# EAGLE schematic middleman pcb (EAGLE 9.5.0)
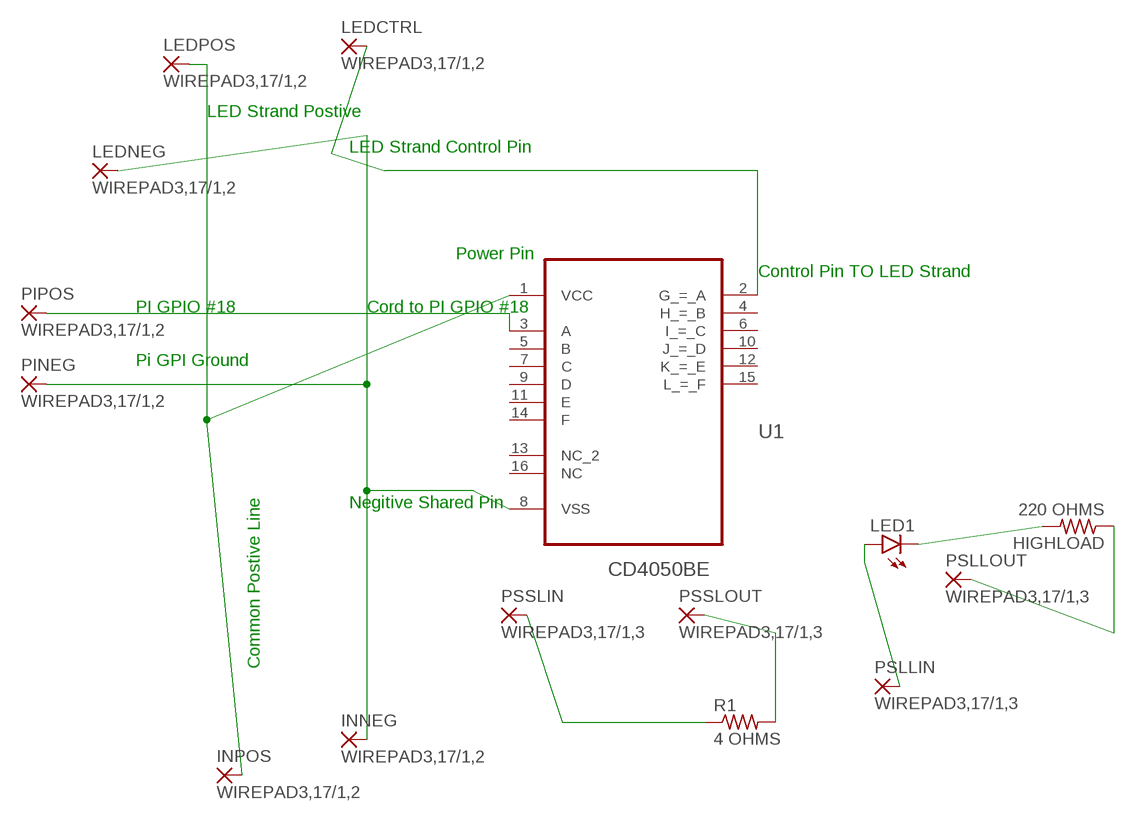
[diagram p0: schematic, sheet 1]

## Parts
HIGHLOAD  220 OHMS  R-US_R0805  [R0805]
INNEG  WIREPAD3,17/1,2  [3,17/1,2]
INPOS  WIREPAD3,17/1,2  [3,17/1,2]
LED1  LED3MM  [LED3MM]
LEDCTRL  WIREPAD3,17/1,2  [3,17/1,2]
LEDNEG  WIREPAD3,17/1,2  [3,17/1,2]
LEDPOS  WIREPAD3,17/1,2  [3,17/1,2]
PINEG  WIREPAD3,17/1,2  [3,17/1,2]
PIPOS  WIREPAD3,17/1,2  [3,17/1,2]
PSLLIN  WIREPAD3,17/1,3  [3,17/1,3]
PSLLOUT  WIREPAD3,17/1,3  [3,17/1,3]
PSSLIN  WIREPAD3,17/1,3  [3,17/1,3]
PSSLOUT  WIREPAD3,17/1,3  [3,17/1,3]
R1  4 OHMS  R-US_R0805  [R0805]
U1  CD4050BE  [DIP254P762X508-16]

## Nets
N$1: INPOS.1(P) LEDPOS.1(P) U1.1(VCC)
N$2: LEDCTRL.1(P) U1.2(G_=_A)
N$3: PIPOS.1(P) U1.3(A)
N$4: LED1.A PSLLIN.1(P)
N$5: INNEG.1(P) LEDNEG.1(P) PINEG.1(P) U1.8(VSS)
N$6: HIGHLOAD.2 LED1.K(C)
N$7: HIGHLOAD.1 PSLLOUT.1(P)
N$8: PSSLIN.1(P) R1.1
N$9: PSSLOUT.1(P) R1.2
Unconnected: U1.4(H_=_B) U1.5(B) U1.6(I_=_C) U1.7(C) U1.9(D) U1.10(J_=_D) U1.11(E) U1.12(K_=_E) U1.13(NC_2) U1.14(F) U1.15(L_=_F) U1.16(NC)

## Notes on the sheet
- LED Strand Postive
- LED Strand Control Pin
- Power Pin
- Control Pin TO LED Strand
- PI GPIO #18 | Cord to PI GPIO #18
- Pi GPI Ground
- Negitive Shared Pin
- Common Postive Line

## Library data of the parts
HIGHLOAD R1 = rcl:R-US_: RESISTOR, American symbol; SPICEPREFIX: R
INNEG INPOS LEDCTRL LEDNEG LEDPOS PINEG PIPOS PSLLIN PSLLOUT PSSLIN PSSLOUT = wirepad:WIREPAD: Wire PAD connect wire on PCB
LED1 = led:LED: LED OSRAM: - CHIPLED LG R971, LG N971, LY N971, LG Q971, LY Q971, LO R971, LY R971 LH N974, LH R974 LS Q976, LO Q976, LY Q976 LO Q996 - Hyper CHIPLED LW Q18S LB Q993, LB Q99A, LB R99A - SideLED LS A670, LO A670, LY A670, LG A670, LP A670 LB A673, LV A673, LT A673, LW A673 LH A674 LY A675 LS A676, LA A676, LO A676, LY A676, LW A676 LS A679, LY A679, LG A679 - Hyper Micro SIDELED® LS Y876, LA Y876, LO Y876, LY Y876 LT Y87S - SmartLED LW L88C, LW L88S LB L89C, LB L89S, LG L890 LS L89K, LO L89K, LY L89K LS L896, LA L896, LO L896, LY L896 - TOPLED LS T670, LO T670, LY T670, LG T670, LP T670 LSG T670, LSP T670, LSY T670, LOP T670, LYG T670 LG T671, LOG T671, LSG T671 LB T673, LV T673, LT T673, LW T673 LH T674 LS T676, LA T676, LO T676, LY T676, LB T676, LH T676, LSB T676, LW T676 LB T67C, LV T67C, LT T67C, LS T67K, LO T67K, LY T67K, LW E67C LS E67B, LA E67B, LO E67B, LY E67B, LB E67C, LV E67C, LT E67C LW T67C LS T679, LY T679, LG T679 LS T770, LO T770, LY T770, LG T770, LP T770 LB T773, LV T773, LT T773, LW T773 LH T774 LS E675, LA E675, LY E675, LS T675 LS T776, LA T776, LO T776, LY T776, LB T776 LHGB T686 LT T68C, LB T68C - Hyper Mini TOPLED® LB M676 - Mini TOPLED Santana® LG M470 LS M47K, LO M47K, LY M47K Source: http://www.osram.convergy.de LUXEON: - LUMILED® LXK2-PW12-R00, LXK2-PW12-S00, LXK2-PW14-U00, LXK2-PW14-V00 LXK2-PM12-R00, LXK2-PM12-S00, LXK2-PM14-U00 LXK2-PE12-Q00, LXK2-PE12-R00, LXK2-PE12-S00, LXK2-PE14-T00, LXK2-PE14-U00 LXK2-PB12-K00, LXK2-PB12-L00, LXK2-PB12-M00, LXK2-PB14-N00, LXK2-PB14-P00, LXK2-PB14-Q00 LXK2-PR12-L00, LXK2-PR12-M00, LXK2-PR14-Q00, LXK2-PR14-R00 LXK2-PD12-Q00, LXK2-PD12-R00, LXK2-PD12-S00 LXK2-PH12-R00, LXK2-PH12-S00 LXK2-PL12-P00, LXK2-PL12-Q00, LXK2-PL12-R00 Source: www.luxeon.com KINGBRIGHT: KA-3528ASYC Source: www.kingbright.com
U1 = CD4050BE:CD4050BE: CMOS Hex Buffer/Converters; AVAILABILITY: Unavailable; MF: Texas Instruments; MP: CD4050BE; PACKAGE: DIP-16 Intersil; PRICE: None